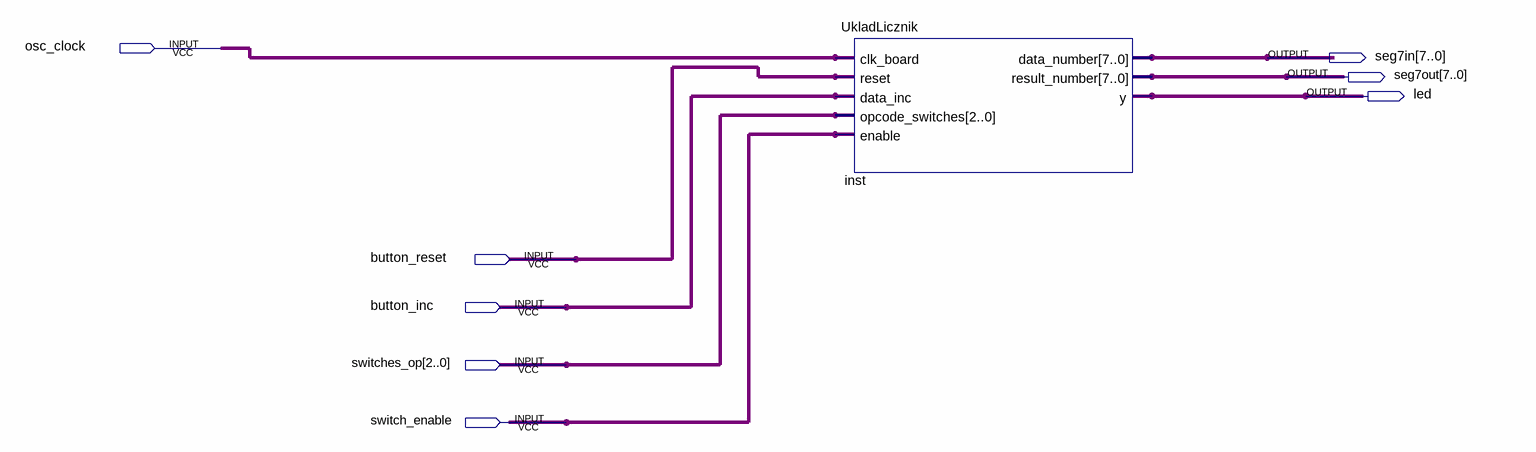
[diagram p0: schematic sheet]
// Quartus schematic UkladLicznikGeneral.bdf as structural Verilog: 1 symbols, 8 pins
module UkladLicznikGeneral (
  input  osc_clock,
  input  button_reset,
  input  button_inc,
  input  [2:0] switches_op,
  input  switch_enable,
  output [7:0] seg7in,
  output [7:0] seg7out,
  output led
);

  UkladLicznik inst (
    .clk_board(osc_clock), .reset(button_reset), .data_inc(button_inc), .opcode_switches(switches_op),
    .enable(switch_enable), .data_number(seg7in), .result_number(seg7out), .y(led));
endmodule
